# Altium project AC_POWER_MEASURING.PrjPcb
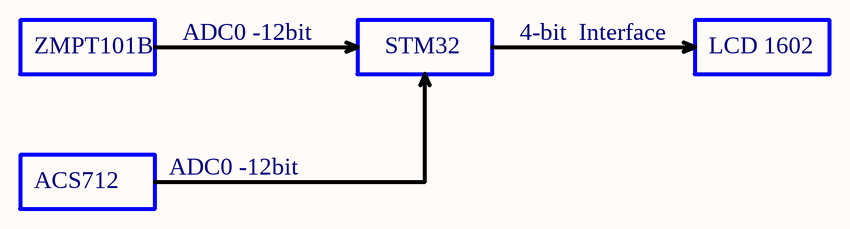
[diagram p0: Block_Diagram.SchDoc]
6 sheets, 76 parts. Net scope: global (net labels, ports and power ports of the same name join across sheets).
Board files: test_measure.PcbDoc, multi_test_measure.PcbDoc, ver1.PcbDoc, ver2.PcbDoc, ver3.PcbDoc
Sheets:
  Block_Diagram.SchDoc
  Power_Diagram.SchDoc
  Power_Supply.SchDoc
  MCU.SchDoc
  Measure.SchDoc
  Display.SchDoc

## Sheet Block_Diagram.SchDoc: AC POWER METER
size 420 x 297 mm; DrawnBy: Truong Giang; DocumentNumber: Learning; SheetNumber: 1; SheetTotal: 6

### Notes on the sheet
- ZMPT101B
- ADC0 -12bit
- STM32
- 4-bit  Interface
- LCD 1602
- ACS712
- PROJECT
- TITLE
- DRAWN BY
- SIZE
- FILE NAME
- SHEET
- OF
- A3

## Sheet Power_Diagram.SchDoc: AC POWER METER
size 420 x 297 mm; DrawnBy: Truong Giang; DocumentNumber: Learning
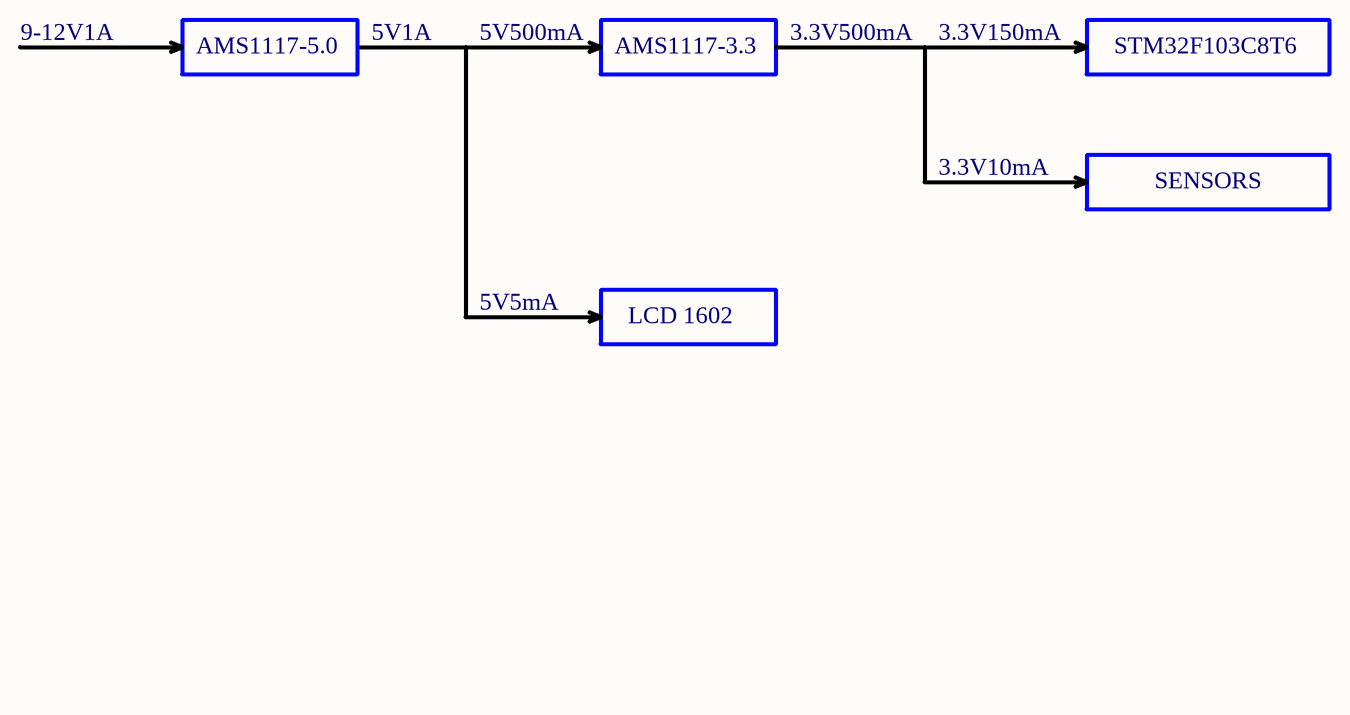
[diagram p1: Power_Diagram.SchDoc]

### Notes on the sheet
- 9-12V1A
- AMS1117-5.0
- 5V1A
- 5V500mA
- AMS1117-3.3
- 3.3V500mA
- 3.3V150mA
- STM32F103C8T6
- 3.3V10mA
- SENSORS
- 5V5mA
- LCD 1602
- PROJECT
- TITLE
- DRAWN BY
- SIZE
- FILE NAME
- SHEET
- OF
- A3

## Sheet Power_Supply.SchDoc: AC POWER METER
size 420 x 297 mm; DrawnBy: Truong Giang; DocumentNumber: Learning; SheetNumber: 3; SheetTotal: 6
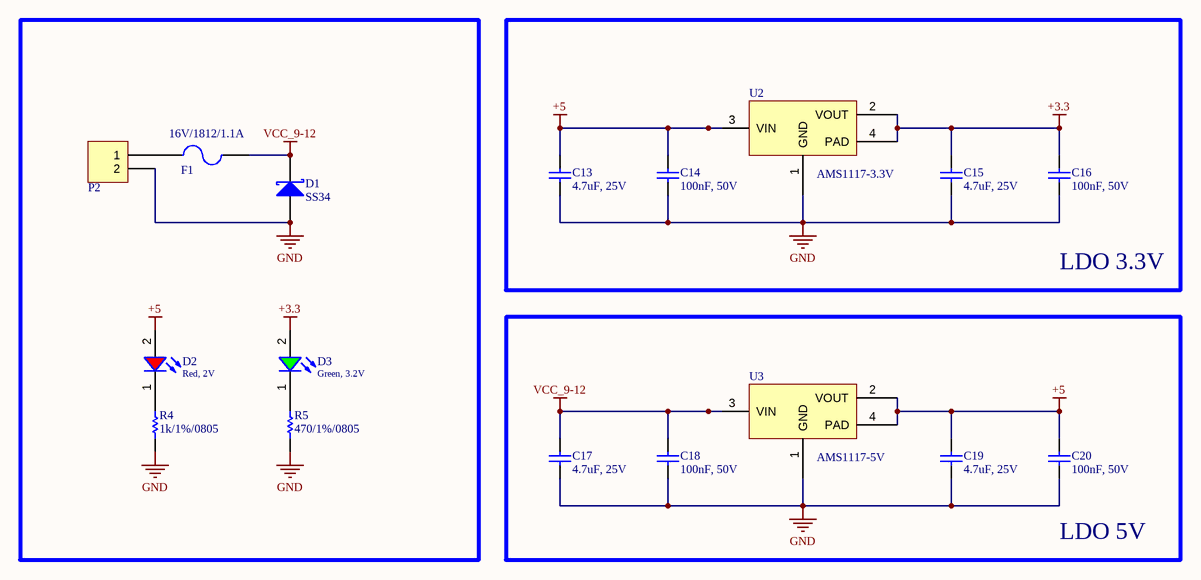
[diagram p2: Power_Supply.SchDoc]

### Parts
C13  4.7uF, 25V  [WCAP-CSGP_0805_H=1.25mm]
C14  100nF, 50V  [WCAP-CSGP_0805_H=0.8mm_Wave]
C15  4.7uF, 25V  [WCAP-CSGP_0805_H=1.25mm]
C16  100nF, 50V  [WCAP-CSGP_0805_H=0.8mm_Wave]
C17  4.7uF, 25V  [WCAP-CSGP_0805_H=1.25mm]
C18  100nF, 50V  [WCAP-CSGP_0805_H=0.8mm_Wave]
C19  4.7uF, 25V  [WCAP-CSGP_0805_H=1.25mm]
C20  100nF, 50V  [WCAP-CSGP_0805_H=0.8mm_Wave]
D1  D Schottky  [SS34]  (value not drawn)
D2  Red, 2V  [WL-SMCW_0805]
D3  Green, 3.2V  [WL-SMCW_0805]
F1  Fuse  [FUSE SMD]  (value not drawn)
P2  Domino 2  [DOMINO 2- 5mm]  (value not drawn)
R4  value 1k/1%/0805  [RES-SM-0805]  (hidden comment: RESISTOR SMD)
R5  value 470/1%/0805  [RES-SM-0805]  (hidden comment: RESISTOR SMD)
U2  AMS1117-3.3V  [SOT230P700X180-4N]
U3  AMS1117-5V  [SOT230P700X180-4N]

### Blocks framed on the sheet
16V/1812/1.1A: D1-D3 F1 P2 R4 R5
LDO 3.3V: C13-C16 U2
LDO 5V: C17-C20 U3

### Nets
+3.3: C15.2 C16.2 D3.2(A) U2.2(VOUT) U2.4(PAD)
+5: C13.2 C14.2 C19.2 C20.2 D2.2(A) U2.3(VIN) U3.2(VOUT) U3.4(PAD)
GND: C13.1 C14.1 C15.1 C16.1 C17.1 C18.1 C19.1 C20.1 D1.A P2.2 R4.1 R5.1 U2.1(GND) U3.1(GND)
VCC_9-12: C17.2 C18.2 D1.K F1.2 U3.3(VIN)
NetD2_1: D2.1(K) R4.2
NetD3_1: D3.1(K) R5.2
NetF1_1: F1.1 P2.1

### Notes on the sheet
- PROJECT
- TITLE
- DRAWN BY
- SIZE
- FILE NAME
- SHEET
- OF
- A3

### Library data of the parts
C13 C15 C17 C19 = 885012107018: WCAP-CSGP Multilayer Ceramic Chip Capacitor, General Purpose, size 0805, X5R, 4.7uF, 25V; Manufacturer: Wurth Elektronik; Rated Voltage: 25VDC; Isolation Resistance: >=0.02GOhm; Capacitance Tolerance: +/-20%; Technical Reference: X5R0805475M025DFCT10000; ComponentLink1Description: Manufacturer; ComponentLink1URL: http://www.we-online.de; ComponentLink2Description: Datasheet; ComponentLink2URL: https://www.we-online.com/catalog/datasheet/885012107018.pdf; Operating Temperature: -55 to +85degC; Packaging: Tape and Reel; Manufacturer Part Number: 885012107018; Published Date: May 2020; Ceramic Type: X5R; Dissipation Factor: =<10%; Height: 1.25mm; Mounting Technology: SMT; Size: 0805; Capacitance: 4.7uF
C14 C16 C18 C20 = 885012207098: WCAP-CSGP Multilayer Ceramic Chip Capacitor, General Purpose, size 0805, X7R, 100nF, 50V; Manufacturer: Wurth Elektronik; Rated Voltage: 50VDC; Isolation Resistance: >=5GOhm; Capacitance Tolerance: +/-10%; Technical Reference: X7R0805104K050DFCT10000; ComponentLink1Description: Manufacturer; ComponentLink1URL: http://www.we-online.de; ComponentLink2Description: Datasheet; ComponentLink2URL: https://www.we-online.com/catalog/datasheet/885012207098.pdf; Operating Temperature: -55 to +125degC; Packaging: Tape and Reel; Manufacturer Part Number: 885012207098; Published Date: May 2020; Ceramic Type: X7R; Dissipation Factor: =<2.5%; Height: 0.8mm; Mounting Technology: SMT; Size: 0805; Capacitance: 100nF
D1 = D Schottky: Schottky Diode; Published: 8-Jun-2000; LatestRevisionDate: 17-Jul-2002; LatestRevisionNote: Re-released for DXP Platform.; PackageReference: SMB; Publisher: Altium Limited; PackageDescription: DO-214-AA/SMB; 2 C-Bend Leads; Body 5.3 x 3.6 mm, inc. leads (LxW); Code_JEDEC: DO-214-AA; Supplier 1: Arrow Electronics; Supplier 2: RSComponents; Supplier Part Number 1: SS34; Supplier Part Number 2: 8080433
D2 = 150080RS75000: WL-SMCW SMT Mono-color Chip LED Waterclear, size 0805, Red, 2V, 140deg; Chip Technology: AlInGaP; Dominant Wavelength typ.: 625nm; Luminous Intensity typ.: 150mcd; Peak Wavelength typ.: 630nm; Viewing Angle: 140deg; ComponentLink1Description: Manufacturer; ComponentLink1URL: http://www.we-online.de; ComponentLink2URL: https://www.we-online.com/catalog/datasheet/150080RS75000.pdf; ComponentLink2Description: Datasheet; Forward Voltage typ.: 2V; Emitting Color: Red; Mounting Technology: SMT; Operating Temperature: -40 to +85degC; Published Date: December 2019; Part Number: 150080RS75000; Packaging: Tape and Reel; Size: 0805; Publisher: Wurth Elektronik
D3 = 150080GS75000: WL-SMCW SMT Mono-color Chip LED Waterclear, size 0805, Green, 3.2V, 140deg; Chip Technology: InGaN; Dominant Wavelength typ.: 525nm; Luminous Intensity typ.: 450mcd; Peak Wavelength typ.: 515nm; Viewing Angle: 140deg; ComponentLink1Description: Manufacturer; ComponentLink1URL: http://www.we-online.de; ComponentLink2URL: https://www.we-online.com/catalog/datasheet/150080GS75000.pdf; ComponentLink2Description: Datasheet; Forward Voltage typ.: 3.2V; Emitting Color: Green; Mounting Technology: SMT; Operating Temperature: -40 to +85degC; Published Date: December 2019; Part Number: 150080GS75000; Packaging: Tape and Reel; Size: 0805; Publisher: Wurth Elektronik
P2 = Domino 2: Domino, 2-Pin; LatestRevisionDate: 17-Jul-2002; LatestRevisionNote: Re-released for DXP Platform.; Publisher: Altium Limited
R4 R5 = RESISTOR SMD: Resistor

## Sheet MCU.SchDoc: AC POWER METER
size 420 x 297 mm; DrawnBy: Truong Giang; DocumentNumber: Learning; SheetNumber: 4; SheetTotal: 6
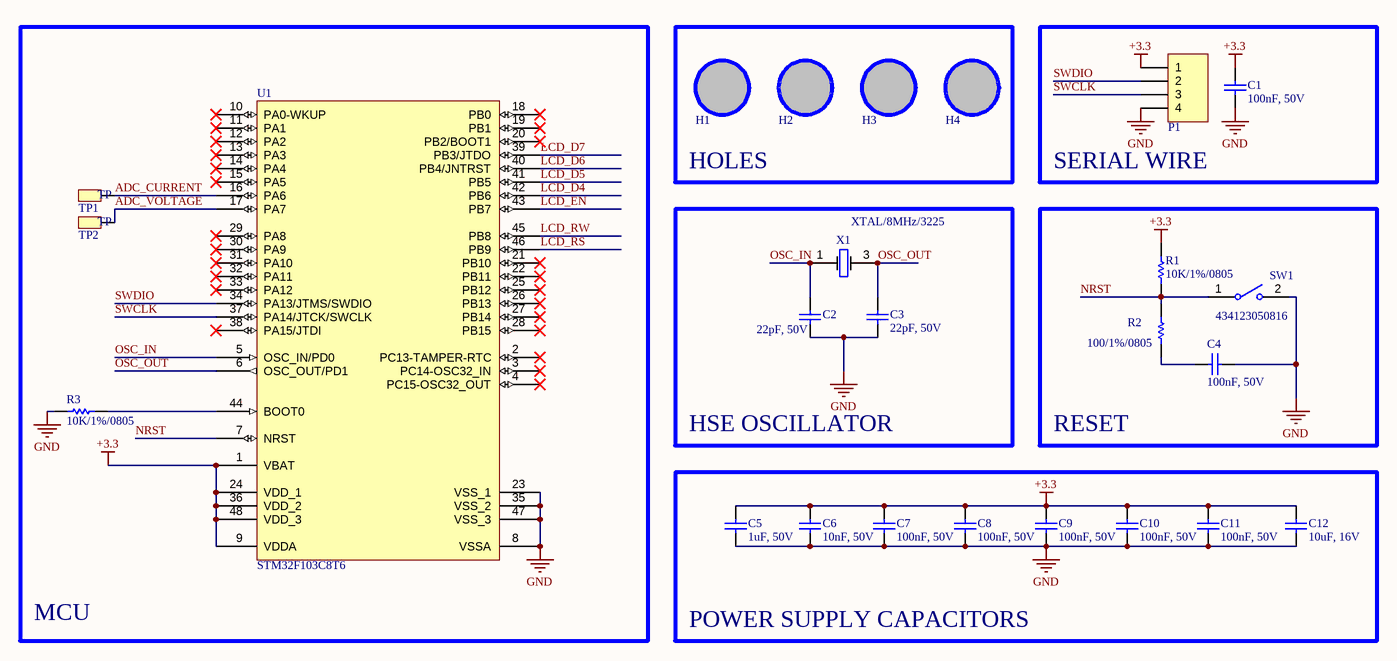
[diagram p3: MCU.SchDoc]

### Parts
C1  100nF, 50V  [WCAP-CSGP_0805_H=0.8mm_Wave]
C2  22pF, 50V  [WCAP-CSGP_0805_H=0.6mm_Reflow]
C3  22pF, 50V  [WCAP-CSGP_0805_H=0.6mm_Reflow]
C4  100nF, 50V  [WCAP-CSGP_0805_H=0.8mm_Wave]
C5  1uF, 50V  [WCAP-CSGP_0805_H=1.25mm]
C6  10nF, 50V  [WCAP-CSGP_0805_H=0.8mm_Reflow]
C7  100nF, 50V  [WCAP-CSGP_0805_H=0.8mm_Wave]
C8  100nF, 50V  [WCAP-CSGP_0805_H=0.8mm_Wave]
C9  100nF, 50V  [WCAP-CSGP_0805_H=0.8mm_Wave]
C10  100nF, 50V  [WCAP-CSGP_0805_H=0.8mm_Wave]
C11  100nF, 50V  [WCAP-CSGP_0805_H=0.8mm_Wave]
C12  10uF, 16V  [WCAP-CSGP_0805_H=1.25mm]
H1  Hole  [LO KHOAN 3MM]  (value not drawn)
H2  Hole  [LO KHOAN 3MM]  (value not drawn)
H3  Hole  [LO KHOAN 3MM]  (value not drawn)
H4  Hole  [LO KHOAN 3MM]  (value not drawn)
P1  Header 4  [JP4]  (value not drawn)
R1  value 10K/1%/0805  [RES-SM-0805]  (hidden comment: RESISTOR SMD)
R2  value 100/1%/0805  [RES-SM-0805]  (hidden comment: RESISTOR SMD)
R3  value 10K/1%/0805  [RES-SM-0805]  (hidden comment: RESISTOR SMD)
SW1  434123050816  [WS-TASV_L6W3.5H5_4341x30508x6]
TP1  Test Point  [TP]  (value not drawn)
TP2  Test Point  [TP]  (value not drawn)
U1  STM32F103C8T6  [TSQFP50P900X900X160-48N]
X1  XTAL/8MHz/3225  [XTAL 3225]

### Blocks framed on the sheet
MCU: R3 TP1 TP2 U1
HOLES: H1-H4
SERIAL WIRE: C1 P1
HSE OSCILLATOR: C2 C3 X1
RESET: C4 R1 R2 SW1
POWER SUPPLY CAPACITORS: C5-C12

### Nets
+3.3: C1.1 C5.2 C6.2 C7.2 C8.2 C9.2 C10.2 C11.2 C12.2 P1.1 R1.2 U1.1(VBAT) U1.9(VDDA) U1.24(VDD_1) U1.36(VDD_2) U1.48(VDD_3)
GND: C1.2 C2.1 C3.1 C4.1 C5.1 C6.1 C7.1 C8.1 C9.1 C10.1 C11.1 C12.1 P1.4 R3.2 SW1.2 U1.8(VSSA) U1.23(VSS_1) U1.35(VSS_2) U1.47(VSS_3)
ADC_CURRENT: TP1.TP1 U1.16(PA6)
ADC_VOLTAGE: TP2.TP1 U1.17(PA7)
LCD_D4: U1.42(PB6)
LCD_D5: U1.41(PB5)
LCD_D6: U1.40(PB4/JNTRST)
LCD_D7: U1.39(PB3/JTDO)
LCD_EN: U1.43(PB7)
LCD_RS: U1.46(PB9)
LCD_RW: U1.45(PB8)
NRST: R1.1 R2.2 SW1.1 U1.7(NRST)
OSC_IN: C2.2 U1.5(OSC_IN/PD0) X1.1
OSC_OUT: C3.2 U1.6(OSC_OUT/PD1) X1.3
SWCLK: P1.3 U1.37(PA14/JTCK/SWCLK)
SWDIO: P1.2 U1.34(PA13/JTMS/SWDIO)
NetC4_2: C4.2 R2.1
NetR3_1: R3.1 U1.44(BOOT0)

Not connected (* = marked no-connect by the designer): H1 1; H2 1; H3 1; H4 1; U1 2(PC13-TAMPER-RTC)* 3(PC14-OSC32_IN)* 4(PC15-OSC32_OUT)* 10(PA0-WKUP)* 11(PA1)* 12(PA2)* 13(PA3)* 14(PA4)* 15(PA5)* 18(PB0)* 19(PB1)* 20(PB2/BOOT1)* 21(PB10)* 22(PB11)* 25(PB12)* 26(PB13)* 27(PB14)* 28(PB15)* 29(PA8)* 30(PA9)* 31(PA10)* 32(PA11)* 33(PA12)* 38(PA15/JTDI)*

### Notes on the sheet
- PROJECT
- TITLE
- DRAWN BY
- SIZE
- FILE NAME
- SHEET
- OF
- A3
- (in symbol Test Point) TP

### Library data of the parts
C1 C4 C7-C11 = 885012207098: as C14 on sheet Power_Supply; ComponentLink1Description: Manufacturer; ComponentLink1URL: http://www.we-online.de; ComponentLink2Description: Datasheet; ComponentLink2URL: https://www.we-online.com/catalog/datasheet/885012207098.pdf; Operating Temperature: -55 to +125degC; Packaging: Tape and Reel; Manufacturer Part Number: 885012207098; Published Date: May 2020; Ceramic Type: X7R; Dissipation Factor: =<2.5%; Height: 0.8mm; Mounting Technology: SMT; Size: 0805; Capacitance: 100nF
C2 C3 = 885012007053: WCAP-CSGP Multilayer Ceramic Chip Capacitor, General Purpose, size 0805, NP0, 22pF, 50V; Manufacturer: Wurth Elektronik; Rated Voltage: 50VDC; Isolation Resistance: >=10GOhm; Capacitance Tolerance: +/-5%; Dissipation Factor: Q>=400+20C; Technical Reference: NP00805220J050DFCT10000; ComponentLink1Description: Manufacturer; ComponentLink1URL: http://www.we-online.de; ComponentLink2Description: Datasheet; ComponentLink2URL: https://www.we-online.com/catalog/datasheet/885012007053.pdf; Operating Temperature: -55 to +125degC; Packaging: Tape and Reel; Manufacturer Part Number: 885012007053; Published Date: May 2020; Ceramic Type: NP0; Height: 0.6mm; Mounting Technology: SMT; Size: 0805; Capacitance: 22pF
C5 = 885012207103: WCAP-CSGP Multilayer Ceramic Chip Capacitor, General Purpose, size 0805, X7R, 1uF, 50V; Manufacturer: Wurth Elektronik; Rated Voltage: 50VDC; Isolation Resistance: >=0.1GOhm; Capacitance Tolerance: +/-10%; Technical Reference: X7R0805105K050DFCT10000; ComponentLink1Description: Manufacturer; ComponentLink1URL: http://www.we-online.de; ComponentLink2Description: Datasheet; ComponentLink2URL: https://www.we-online.com/catalog/datasheet/885012207103.pdf; Operating Temperature: -55 to +125degC; Packaging: Tape and Reel; Manufacturer Part Number: 885012207103; Published Date: May 2020; Ceramic Type: X7R; Dissipation Factor: =<10%; Height: 1.25mm; Mounting Technology: SMT; Size: 0805; Capacitance: 1uF
C6 = 885012207092: WCAP-CSGP Multilayer Ceramic Chip Capacitor, General Purpose, size 0805, X7R, 10nF, 50V; Manufacturer: Wurth Elektronik; Rated Voltage: 50VDC; Isolation Resistance: >=10GOhm; Capacitance Tolerance: +/-10%; Technical Reference: X7R0805103K050DFCT10000; ComponentLink1Description: Manufacturer; ComponentLink1URL: http://www.we-online.de; ComponentLink2Description: Datasheet; ComponentLink2URL: https://www.we-online.com/catalog/datasheet/885012207092.pdf; Operating Temperature: -55 to +125degC; Packaging: Tape and Reel; Manufacturer Part Number: 885012207092; Published Date: May 2020; Ceramic Type: X7R; Dissipation Factor: =<2.5%; Height: 0.8mm; Mounting Technology: SMT; Size: 0805; Capacitance: 10nF
C12 = 885012107014: WCAP-CSGP Multilayer Ceramic Chip Capacitor, General Purpose, size 0805, X5R, 10uF, 16V; Manufacturer: Wurth Elektronik; Rated Voltage: 16VDC; Isolation Resistance: >=0.005GOhm; Capacitance Tolerance: +/-20%; Technical Reference: X5R0805106M016DFCT10000; ComponentLink1Description: Manufacturer; ComponentLink1URL: http://www.we-online.de; ComponentLink2Description: Datasheet; ComponentLink2URL: https://www.we-online.com/catalog/datasheet/885012107014.pdf; Operating Temperature: -55 to +85degC; Packaging: Tape and Reel; Manufacturer Part Number: 885012107014; Published Date: May 2020; Ceramic Type: X5R; Dissipation Factor: =<10%; Height: 1.25mm; Mounting Technology: SMT; Size: 0805; Capacitance: 10uF
H1-H4 = Hole: Hole 3mm
P1 = Header 4: Header, 4-Pin; LatestRevisionDate: 17-Jul-2002; LatestRevisionNote: Re-released for DXP Platform.; Publisher: Altium Limited
R1-R3 = RESISTOR SMD: Resistor
SW1 = 434123050816: WS-TASV J-Bend SMT Tact Switch, 12VDC, 50mA, 160g, height 5mm; Manufacturer: Wurth Elektronik; Rated Voltage: 12V; Washable: No; Actuator Color: Black; Electrical Life: 50000Cycles; ComponentLink1Description: Manufacturer Link; ComponentLink1URL: http://www.we-online.de; ComponentLink2Description: Datasheet; ComponentLink2URL: https://www.we-online.com/catalog/datasheet/434123050816.pdf; Manufacturer Part Number: 434123050816; Contact Material: Stainless Steel; Mounting Technology: SMT; Contact Plating: Silver; Operation Force: 160g; Packaging: Tape and Reel; Terminal Material: Copper Alloy; Rated Current: 50mA; Terminal Plating: Silver; Height: 5mm; Length: 6mm; Operating Temperature max.: 85C; Operating Temperature min.: -40C; Width: 3.5mm
U1 = STM32F103C8T6: Manufacturer: ST; ComponentLink1Description: Supplier 1 Link
X1 = XTAL: Value: 16MHz

## Sheet Measure.SchDoc: AC POWER METER
size 420 x 297 mm; DrawnBy: Truong Giang; DocumentNumber: Learning; SheetNumber: 5; SheetTotal: 6
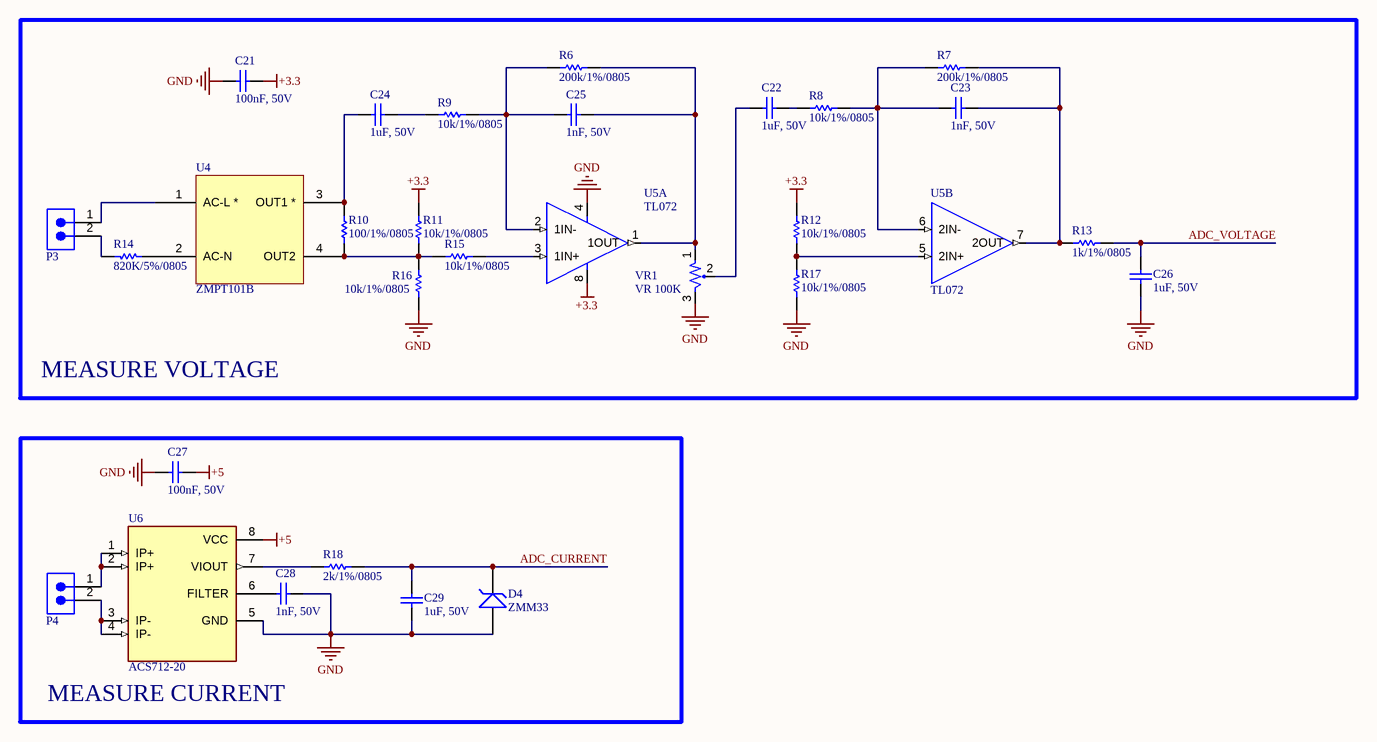
[diagram p4: Measure.SchDoc]

### Parts
C21  100nF, 50V  [WCAP-CSGP_0805_H=0.8mm_Wave]
C22  1uF, 50V  [WCAP-CSGP_0805_H=1.25mm]
C23  1nF, 50V  [WCAP-CSGP_0805_H=0.8mm_Wave]
C24  1uF, 50V  [WCAP-CSGP_0805_H=1.25mm]
C25  1nF, 50V  [WCAP-CSGP_0805_H=0.8mm_Wave]
C26  1uF, 50V  [WCAP-CSGP_0805_H=1.25mm]
C27  100nF, 50V  [WCAP-CSGP_0805_H=0.8mm_Wave]
C28  1nF, 50V  [WCAP-CSGP_0805_H=0.8mm_Wave]
C29  1uF, 50V  [WCAP-CSGP_0805_H=1.25mm]
D4  ZMM33  [SOD-80]
P3  691312710002  [691312710002]  (value not drawn)
P4  691312710002  [691312710002]  (value not drawn)
R6  value 200k/1%/0805  [RES-SM-0805]  (hidden comment: RESISTOR SMD)
R7  value 200k/1%/0805  [RES-SM-0805]  (hidden comment: RESISTOR SMD)
R8  value 10k/1%/0805  [RES-SM-0805]  (hidden comment: RESISTOR SMD)
R9  value 10k/1%/0805  [RES-SM-0805]  (hidden comment: RESISTOR SMD)
R10  value 100/1%/0805  [RES-SM-0805]  (hidden comment: RESISTOR SMD)
R11  value 10k/1%/0805  [RES-SM-0805]  (hidden comment: RESISTOR SMD)
R12  value 10k/1%/0805  [RES-SM-0805]  (hidden comment: RESISTOR SMD)
R13  value 1k/1%/0805  [RES-SM-0805]  (hidden comment: RESISTOR SMD)
R14  value 820K/5%/0805  [RES-SM-0805]  (hidden comment: RESISTOR SMD)
R15  value 10k/1%/0805  [RES-SM-0805]  (hidden comment: RESISTOR SMD)
R16  value 10k/1%/0805  [RES-SM-0805]  (hidden comment: RESISTOR SMD)
R17  value 10k/1%/0805  [RES-SM-0805]  (hidden comment: RESISTOR SMD)
R18  value 2k/1%/0805  [RES-SM-0805]  (hidden comment: RESISTOR SMD)
U4  ZMPT101B  [ZMPT101B]
U5  TL072  [DIP794W45P254L1060H508Q8]  (parts A,B of 2)
U6  ACS712-20  [SOIC127P600X175-8N]
VR1  value VR 100K  [VARISTOR 2]  (hidden comment: 10K)

### Blocks framed on the sheet
MEASURE VOLTAGE: C21-C26 P3 R6-R17 U4 U5 VR1
MEASURE CURRENT: C27-C29 D4 P4 R18 U6

### Nets
+3.3: C21.2 R11.1 R12.1 U5.8(VCC+)
+5: C27.2 U6.8(VCC)
GND: C21.1 C26.1 C27.1 C28.2 C29.1 D4.1(A) R16.1 R17.1 U5.4(VCC-) U6.5(GND) VR1.3
ADC_CURRENT: C29.2 D4.2(K) R18.2
ADC_VOLTAGE: C26.2 R13.2
NetC22_1: C22.1 R8.1
NetC22_2: C22.2 VR1.2
NetC23_1: C23.1 R7.2 R13.1 U5.7(2OUT)
NetC23_2: C23.2 R7.1 R8.2 U5.6(2IN-)
NetC24_1: C24.1 R10.1 U4.3(OUT1_*)
NetC24_2: C24.2 R9.1
NetC25_1: C25.1 R6.1 R9.2 U5.2(1IN-)
NetC25_2: C25.2 R6.2 U5.1(1OUT) VR1.1
NetC28_1: C28.1 U6.6(FILTER)
NetP3_1: P3.1 U4.1(AC-L_*)
NetP3_2: P3.2 R14.2
NetP4_1: P4.1 U6.1(IP+) U6.2(IP+)
NetP4_2: P4.2 U6.3(IP-) U6.4(IP-)
NetR10_2: R10.2 R11.2 R15.1 R16.2 U4.4(OUT2)
NetR12_2: R12.2 R17.2 U5.5(2IN+)
NetR14_1: R14.1 U4.2(AC-N)
NetR15_2: R15.2 U5.3(1IN+)
NetR18_1: R18.1 U6.7(VIOUT)

### Notes on the sheet
- PROJECT
- TITLE
- DRAWN BY
- SIZE
- FILE NAME
- SHEET
- OF
- A3

### Library data of the parts
C21 C27 = 885012207098: as C14 on sheet Power_Supply; ComponentLink1Description: Manufacturer; ComponentLink1URL: http://www.we-online.de; ComponentLink2Description: Datasheet; ComponentLink2URL: https://www.we-online.com/catalog/datasheet/885012207098.pdf; Operating Temperature: -55 to +125degC; Packaging: Tape and Reel; Manufacturer Part Number: 885012207098; Published Date: May 2020; Ceramic Type: X7R; Dissipation Factor: =<2.5%; Height: 0.8mm; Mounting Technology: SMT; Size: 0805; Capacitance: 100nF
C22 C24 C26 C29 = 885012207103: as C5 on sheet MCU; ComponentLink1Description: Manufacturer; ComponentLink1URL: http://www.we-online.de; ComponentLink2Description: Datasheet; ComponentLink2URL: https://www.we-online.com/catalog/datasheet/885012207103.pdf; Operating Temperature: -55 to +125degC; Packaging: Tape and Reel; Manufacturer Part Number: 885012207103; Published Date: May 2020; Ceramic Type: X7R; Dissipation Factor: =<10%; Height: 1.25mm; Mounting Technology: SMT; Size: 0805; Capacitance: 1uF
C23 C25 C28 = 885012007063: WCAP-CSGP Multilayer Ceramic Chip Capacitor, General Purpose, size 0805, NP0, 1nF, 50V; Manufacturer: Wurth Elektronik; Rated Voltage: 50VDC; Isolation Resistance: >=10GOhm; Capacitance Tolerance: +/-5%; Dissipation Factor: Q>=1000; Technical Reference: NP00805102J050DFCT10000; ComponentLink1Description: Manufacturer; ComponentLink1URL: http://www.we-online.de; ComponentLink2Description: Datasheet; ComponentLink2URL: https://www.we-online.com/catalog/datasheet/885012007063.pdf; Operating Temperature: -55 to +125degC; Packaging: Tape and Reel; Manufacturer Part Number: 885012007063; Published Date: May 2020; Ceramic Type: NP0; Height: 0.8mm; Mounting Technology: SMT; Size: 0805; Capacitance: 1nF
D4 = ZMM33: Diode Zenner
P3 P4 = 691312710002: WR-TBL Series 3127 Open Horizontal PCB Header, THT, pitch 5mm, 2p; Manufacturer: Wurth Elektronik; Modularity: No; Rated Current: 20A; Working Voltage: 300V; ComponentLink1Description: Website Link; ComponentLink1URL: https://www.we-online.com/redexpert/article/691312710002?ad; ComponentLink2Description: Datasheet Link; ComponentLink2URL: https://www.we-online.com/redexpert/spec/691312710002?ad; Manufacturer Part Number: 691312710002; Category: Terminal Blocks; Match Code: WR-TBL; Mount: Through Hole; Operating Temperature Max: 105°C; Operating Temperature Min: -40°C; Packaging: Box; Application: Pluggable; Number of Pins: 2; Number of Rows: 1; Orientation: Horizontal; Pitch: 5mm
R6-R18 = RESISTOR SMD: Resistor
U4 = ZMPT101B: Minuscule 2mA/2mA Precision Voltage Transformer
U5 = TL072: J-FET Amplifier 2 Circuit 8-SO; MF: STMicroelectronics; Package: SOIC-8 STMicroelectronics; Value: *; Price: None; MP: TL072; SnapEDA_Link: https://www.snapeda.com/parts/TL072/STMicroelectronics/view-part/1499677/?ref=snap; Availability: Unavailable
U6 = ACS712-20: ACS712: IC de sensor de corriente lineal basado en efecto Hall totalmente integrado con aislamiento de voltaje de 2,1 kV RMS y un conductor de corriente de baja resistencia; MF: Analog Devices; Value: *; MP: ACS712-20; Price: None; Package: None; Availability: In Stock; SnapEDA_Link: https://www.snapeda.com/parts/ACS712-20/Analog+Devices/view-part/?ref=snap; Check_prices: https://www.snapeda.com/parts/ACS712-20/Analog+Devices/view-part/?ref=eda
VR1 = Var Resistor

## Sheet Display.SchDoc: AC POWER METER
size 420 x 297 mm; DrawnBy: Truong Giang; DocumentNumber: Learning; SheetNumber: 6; SheetTotal: 6
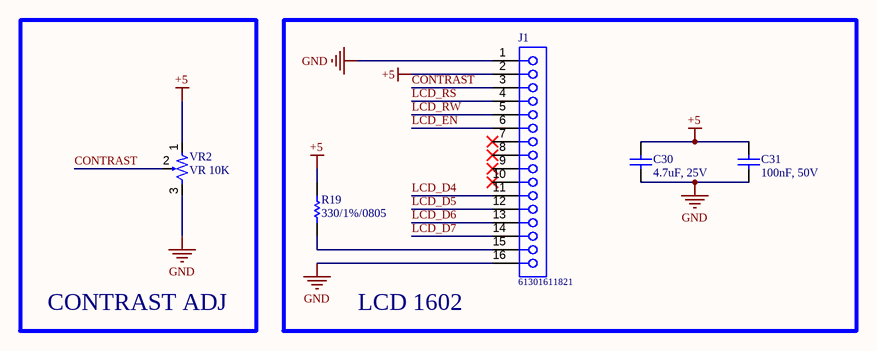
[diagram p5: Display.SchDoc]

### Parts
C30  4.7uF, 25V  [WCAP-CSGP_0805_H=1.25mm]
C31  100nF, 50V  [WCAP-CSGP_0805_H=0.8mm_Wave]
J1  61301611821  [61301611821]
R19  value 330/1%/0805  [RES-SM-0805]  (hidden comment: RESISTOR SMD)
VR2  value VR 10K  [VARISTOR 2]  (hidden comment: 10K)

### Blocks framed on the sheet
CONTRAST ADJ: VR2
LCD 1602: C30 C31 J1 R19

### Nets
+5: C30.2 C31.2 J1.2 R19.2 VR2.1
GND: C30.1 C31.1 J1.1 J1.16 VR2.3
CONTRAST: J1.3 VR2.2
LCD_D4: J1.11
LCD_D5: J1.12
LCD_D6: J1.13
LCD_D7: J1.14
LCD_EN: J1.6
LCD_RS: J1.4
LCD_RW: J1.5
NetJ1_15: J1.15 R19.1

Not connected (* = marked no-connect by the designer): J1 7* 8* 9* 10*

### Notes on the sheet
- PROJECT
- TITLE
- DRAWN BY
- SIZE
- FILE NAME
- SHEET
- OF
- A3

### Library data of the parts
C30 = 885012107018: as C13 on sheet Power_Supply; ComponentLink1Description: Manufacturer; ComponentLink1URL: http://www.we-online.de; ComponentLink2Description: Datasheet; ComponentLink2URL: https://www.we-online.com/catalog/datasheet/885012107018.pdf; Operating Temperature: -55 to +85degC; Packaging: Tape and Reel; Manufacturer Part Number: 885012107018; Published Date: May 2020; Ceramic Type: X5R; Dissipation Factor: =<10%; Height: 1.25mm; Mounting Technology: SMT; Size: 0805; Capacitance: 4.7uF
C31 = 885012207098: as C14 on sheet Power_Supply; ComponentLink1Description: Manufacturer; ComponentLink1URL: http://www.we-online.de; ComponentLink2Description: Datasheet; ComponentLink2URL: https://www.we-online.com/catalog/datasheet/885012207098.pdf; Operating Temperature: -55 to +125degC; Packaging: Tape and Reel; Manufacturer Part Number: 885012207098; Published Date: May 2020; Ceramic Type: X7R; Dissipation Factor: =<2.5%; Height: 0.8mm; Mounting Technology: SMT; Size: 0805; Capacitance: 100nF
J1 = 61301611821: WR-PHD Socket Header, THT, pitch 2.54mm, Single Row, Vertical, 16p; Manufacturer: Wurth Elektronik; Pin Number: 16; Rated Current: 3A; Working Voltage: 250VAC; Withstanding Voltage: 500VAC; Contact Resistance: 20mOhm; ComponentLink1Description: Manufacturer; ComponentLink1URL: http://www.we-online.de; ComponentLink2Description: Datasheet; ComponentLink2URL: https://www.we-online.com/catalog/datasheet/61301611821.pdf; Manufacturer Part Number: 61301611821; Published Date: May 2020; Pitch: 2.54mm; Operating Temperature: -40 to +125degC; Mounting Technology: THT; Packaging: Tray; Gender: Socket Header; Row Number: Single; Orientation: Vertical
R19 = RESISTOR SMD: Resistor
VR2 = Var Resistor

## Nets that join several sheets
+3.3: Power_Supply (5 pins), MCU (16 pins), Measure (C21.2 R11.1 R12.1 U5.8)
+5: Power_Supply (8 pins), Measure (C27.2 U6.8), Display (5 pins)
GND: Power_Supply (14 pins), MCU (19 pins), Measure (11 pins), Display (5 pins)
ADC_CURRENT: MCU (TP1.TP1 U1.16), Measure (C29.2 D4.2 R18.2)
ADC_VOLTAGE: MCU (TP2.TP1 U1.17), Measure (C26.2 R13.2)
LCD_D4: MCU (U1.42), Display (J1.11)
LCD_D5: MCU (U1.41), Display (J1.12)
LCD_D6: MCU (U1.40), Display (J1.13)
LCD_D7: MCU (U1.39), Display (J1.14)
LCD_EN: MCU (U1.43), Display (J1.6)
LCD_RS: MCU (U1.46), Display (J1.4)
LCD_RW: MCU (U1.45), Display (J1.5)